# EAGLE schematic Patch_Inputs_Sensores v16 (EAGLE 9.7.0)
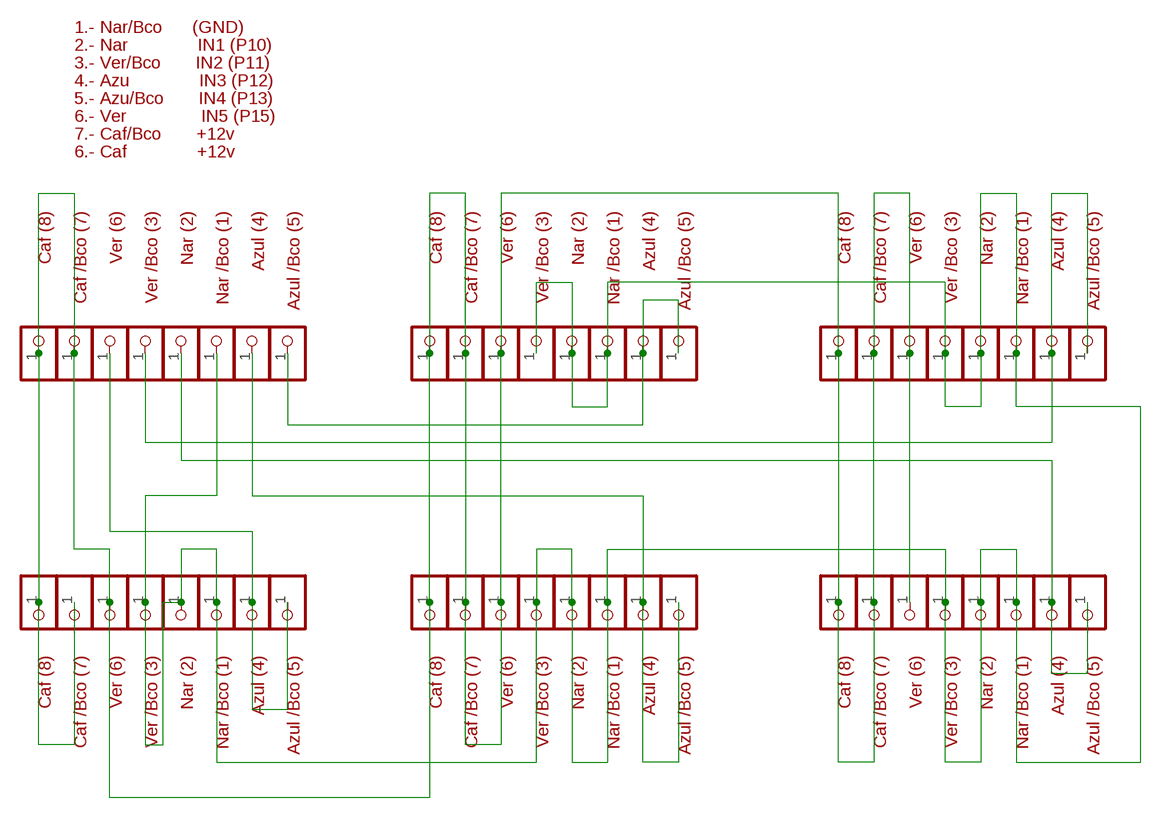
[diagram p0: schematic, sheet 1]

## Parts
JP1  ioiooo  PINHD-1X1  [1X01]
JP2  ioiooo  PINHD-1X1  [1X01]
JP3  ioiooo  PINHD-1X1  [1X01]
JP4  ioiooo  PINHD-1X1  [1X01]
JP5  ioiooo  PINHD-1X1  [1X01]
JP6  ioiooo  PINHD-1X1  [1X01]
JP7  ioiooo  PINHD-1X1  [1X01]
JP8  ioiooo  PINHD-1X1  [1X01]
JP9  ioiooo  PINHD-1X1  [1X01]
JP10  ioiooo  PINHD-1X1  [1X01]
JP11  ioiooo  PINHD-1X1  [1X01]
JP12  ioiooo  PINHD-1X1  [1X01]
JP13  ioiooo  PINHD-1X1  [1X01]
JP14  ioiooo  PINHD-1X1  [1X01]
JP15  ioiooo  PINHD-1X1  [1X01]
JP16  ioiooo  PINHD-1X1  [1X01]
JP17  ioiooo  PINHD-1X1  [1X01]
JP18  ioiooo  PINHD-1X1  [1X01]
JP19  ioiooo  PINHD-1X1  [1X01]
JP20  ioiooo  PINHD-1X1  [1X01]
JP21  ioiooo  PINHD-1X1  [1X01]
JP22  ioiooo  PINHD-1X1  [1X01]
JP23  ioiooo  PINHD-1X1  [1X01]
JP24  ioiooo  PINHD-1X1  [1X01]
JP25  ioiooo  PINHD-1X1  [1X01]
JP26  ioiooo  PINHD-1X1  [1X01]
JP27  ioiooo  PINHD-1X1  [1X01]
JP28  ioiooo  PINHD-1X1  [1X01]
JP29  ioiooo  PINHD-1X1  [1X01]
JP30  ioiooo  PINHD-1X1  [1X01]
JP31  ioiooo  PINHD-1X1  [1X01]
JP32  ioiooo  PINHD-1X1  [1X01]
JP33  ioiooo  PINHD-1X1  [1X01]
JP34  ioiooo  PINHD-1X1  [1X01]
JP35  ioiooo  PINHD-1X1  [1X01]
JP36  ioiooo  PINHD-1X1  [1X01]
JP37  ioiooo  PINHD-1X1  [1X01]
JP38  ioiooo  PINHD-1X1  [1X01]
JP39  ioiooo  PINHD-1X1  [1X01]
JP40  ioiooo  PINHD-1X1  [1X01]
JP75  ioiooo  PINHD-1X1  [1X01]
JP77  ioiooo  PINHD-1X1  [1X01]
JP78  ioiooo  PINHD-1X1  [1X01]
JP79  ioiooo  PINHD-1X1  [1X01]
JP80  ioiooo  PINHD-1X1  [1X01]
JP81  ioiooo  PINHD-1X1  [1X01]
JP82  ioiooo  PINHD-1X1  [1X01]
JP83  ioiooo  PINHD-1X1  [1X01]

## Nets
N$1: JP5.1 JP6.1 JP8.1 JP9.1 JP10.1 JP15.1 JP21.1 JP22.1 JP24.1 JP25.1 JP26.1 JP31.1 JP38.1 JP40.1 JP75.1 JP77.1 JP82.1
N$2: JP2.1 JP3.1 JP4.1 JP11.1 JP12.1 JP13.1 JP18.1 JP19.1 JP20.1 JP27.1 JP28.1 JP29.1 JP34.1 JP78.1 JP79.1 JP80.1
N$3: JP35.1 JP81.1 JP83.1
N$4: JP1.1 JP7.1 JP36.1
N$5: JP14.1 JP16.1 JP33.1
N$6: JP17.1 JP23.1 JP39.1
N$7: JP30.1 JP32.1 JP37.1

## Notes on the sheet
- 1.- Nar/Bco      (GND)
- 2.- Nar              IN1 (P10)
- 3.- Ver/Bco       IN2 (P11)
- 4.- Azu              IN3 (P12)
- 5.- Azu/Bco       IN4 (P13)
- 6.- Ver               IN5 (P15)
- 7.- Caf/Bco       +12v
- 6.- Caf              +12v
- Caf (8) | Caf /Bco (7) | Ver (6) | Ver /Bco (3) | Nar (2) | Nar /Bco (1) | Azul (4) | Azul /Bco (5) | Caf (8) | Caf /Bco (7) | Ver (6) | Ver /Bco (3) | Nar (2) | Nar /Bco (1) | Azul (4) | Azul /Bco (5) | Caf (8) | Caf /Bco (7) | Ver (6) | Ver /Bco (3) | Nar (2) | Nar /Bco (1) | Azul (4) | Azul /Bco (5)
- Caf (8) | Caf /Bco (7) | Ver (6) | Ver /Bco (3) | Nar (2) | Nar /Bco (1) | Azul (4) | Azul /Bco (5) | Caf (8) | Caf /Bco (7) | Ver (6) | Ver /Bco (3) | Nar (2) | Nar /Bco (1) | Azul (4) | Azul /Bco (5) | Caf (8) | Caf /Bco (7) | Ver (6) | Ver /Bco (3) | Nar (2) | Nar /Bco (1) | Azul (4) | Azul /Bco (5)

## Library data of the parts
JP1-JP40 JP75 JP77-JP83 = Connector:PINHD-1X1: PIN HEADER; CATEGORY: Headers; DESCRIPTION: Header, Straight, 1 Position; MANUFACTURER: Generic; MPN: Generic; OPERATING_TEMPERATURE: Generic; PART_STATUS: Active; PITCH: 0.100" (2.54mm); ROHS_COMPLIANCE: Generic; SERIES: Generic; SUB-CATEGORY: Headers, Male Pins; TYPE: Board to Board or Cable, Unshrouded, Through Hole, Straight